# Altium schematic sheet LoRaAntenna.SchDoc: LoRa Antenna
size A4; Engineer: David; DocumentNumber: 6; SheetNumber: 6; SheetTotal: 9; Project: SmartCanton Dev Box; Labo: LSN; PageSetup: Record=PageOptions|CenterHorizontal=True|CenterVertical=True|PrintScale=0.97|XCorrection=1.00|YCorrection=1.00|PrintKind=1|BorderSize=5000000|LeftOffset=0|BottomOffset=0|Orientation=2|PaperLength=1000|PaperWidth=1000|Scale=100|PaperSource=7|PrintQuality=-3|MediaType=1|DitherType=10|PrintScaleMode=1|PaperKind=A4 (210 x 297 mm)|PaperIndex=9
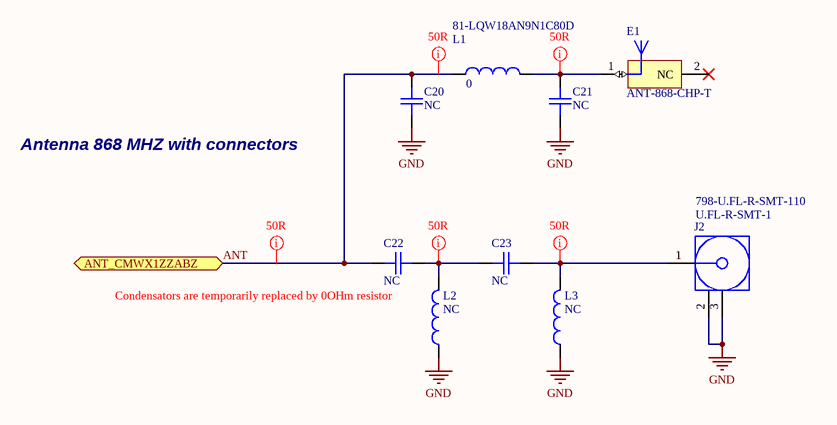
[diagram p0: LoRaAntenna.SchDoc]

## Parts
C20  NC  [CAPC1608X08]
C21  NC  [CAPC1608X08]
C22  NC  [CAPC1608X08]
C23  NC  [CAPC1608X08]
E1  ANT-868-CHP-T  [ANT-868-916-CHP]
J2  U.FL-R-SMT-1  Supplier Part Number 1: 798-U.FL-R-SMT-110  [U.FL-R-SMT-1]
L1  0  Supplier Part Number 1: 81-LQW18AN9N1C80D  [INDC1608X08]
L2  NC  [INDC1608X08]
L3  NC  [INDC1608X08]

## Ports
ANT_CMWX1ZZABZ

## Nets
GND: C20.1 C21.1 J2.2(GND) J2.3(GND) L2.1 L3.1
ANT: C20.2 C22.1 L1.1 ; port ANT_CMWX1ZZABZ
NetC21_2: C21.2 E1.1(FEED) L1.2
NetC22_2: C22.2 C23.1 L2.2
NetC23_2: C23.2 J2.1(Signal) L3.2

Not connected (* = marked no-connect by the designer): E1 2(NC)*

## Layout directives
rule Impedance Constraint [Min = 49.50    Max = 50.50    ]; net class 50R: ANT, NetC21_2, NetC22_2, NetC23_2

## Notes on the sheet
- Antenna 868 MHZ with connectors
- (near L2) Condensators are temporarily replaced by 0OHm resistor
- Title:
- Date:
- Project:
- Engineer:
- Revision:
- Sheet
- of
- Labo:
- File:

## Library data of the parts
C20-C23 = CMP-001-0010-A.3: MLCC Capacitor 1608; RevisionId: A.2; AccessRights: 2147483647; Folder: LSN\Components\Passifs\Condensateurs\; ContentType: Component; LifeCycleStateGUID: 706004B5-C76E-482E-903B-BA0E4FAE086A; ReleaseDate: 31/10/2016 02:21:03 PM; ContentTypeGUID: CB3C11C4-E317-11DF-B822-12313F0024A2; ItemGUID: 6B05C9AF-D3C2-4723-98C2-0E51694C471A; ItemHRID: CMP-001-0010; FolderGUID: 9DA6C5B0-B134-4C0D-99DA-A840DED25FBD; LifeCycle: New From Design; ComponentType: Capacitor; Value: NC
E1 = CMP-00015-A.1: 1/4-wave Monopole Ultra-Compact Chip Antenna, CHP Series, 868MHz, Tape and Reel; Note2: Pin 1 is feed terminal, Pin 2 is for physical support only.; PCB_Layout: Complies with manufacturer's recommendation.; Note1: No ground planes or traces under the antenna; DatasheetVersion: Jan-2009; PackageReference: ANT-868-916-CHP; PackageDescription: SMD Ceramic Antenna, CHP Series, 868/916MHz, 2-Leads, 16.0 x 3.0 x 1.7 mm Body; PackageVersion: Jan-2009; Supplier 1: Mouser; Supplier Part Number 1: 712-ANT-868-CHP-T
J2 = CMP-001-0013-A.3: Hirose U.FL SMT connector; Datasheet: https://www.hirose.com/product/en/download_file/key_name/U.FL/category/Catalog/doc_file_id/31697/?file_category_id=4&item_id=15&is_series=1; Drawing: https://www.hirose.com/product/en/download_file/key_name/U.FL-R-SMT-1%2810%29/category/Drawing%20(2D)/doc_file_id/37627/?file_category_id=6&item_id=03310472210&is_series=; Supplier 1: Mouser
L1-L3 = CMP-001-0101-A.4: Ferrite Beads 1608; RevisionId: A.3; AccessRights: 2147483647; Folder: LSN\Components\Passifs\Inductances\; ContentType: Component; LifeCycleStateGUID: 706004B5-C76E-482E-903B-BA0E4FAE086A; ReleaseDate: 31/07/2017 06:40:06 PM; ContentTypeGUID: CB3C11C4-E317-11DF-B822-12313F0024A2; ItemGUID: 17F6FBB7-027A-4BA7-9144-FCD7399F32FE; ItemHRID: CMP-001-0101; FolderGUID: CF708A04-0EC7-4EEE-8F3D-D187CFC5366D; LifeCycle: New From Design
  L1: value: 0; Supplier 1: Mouser
  L2 L3: value: NC